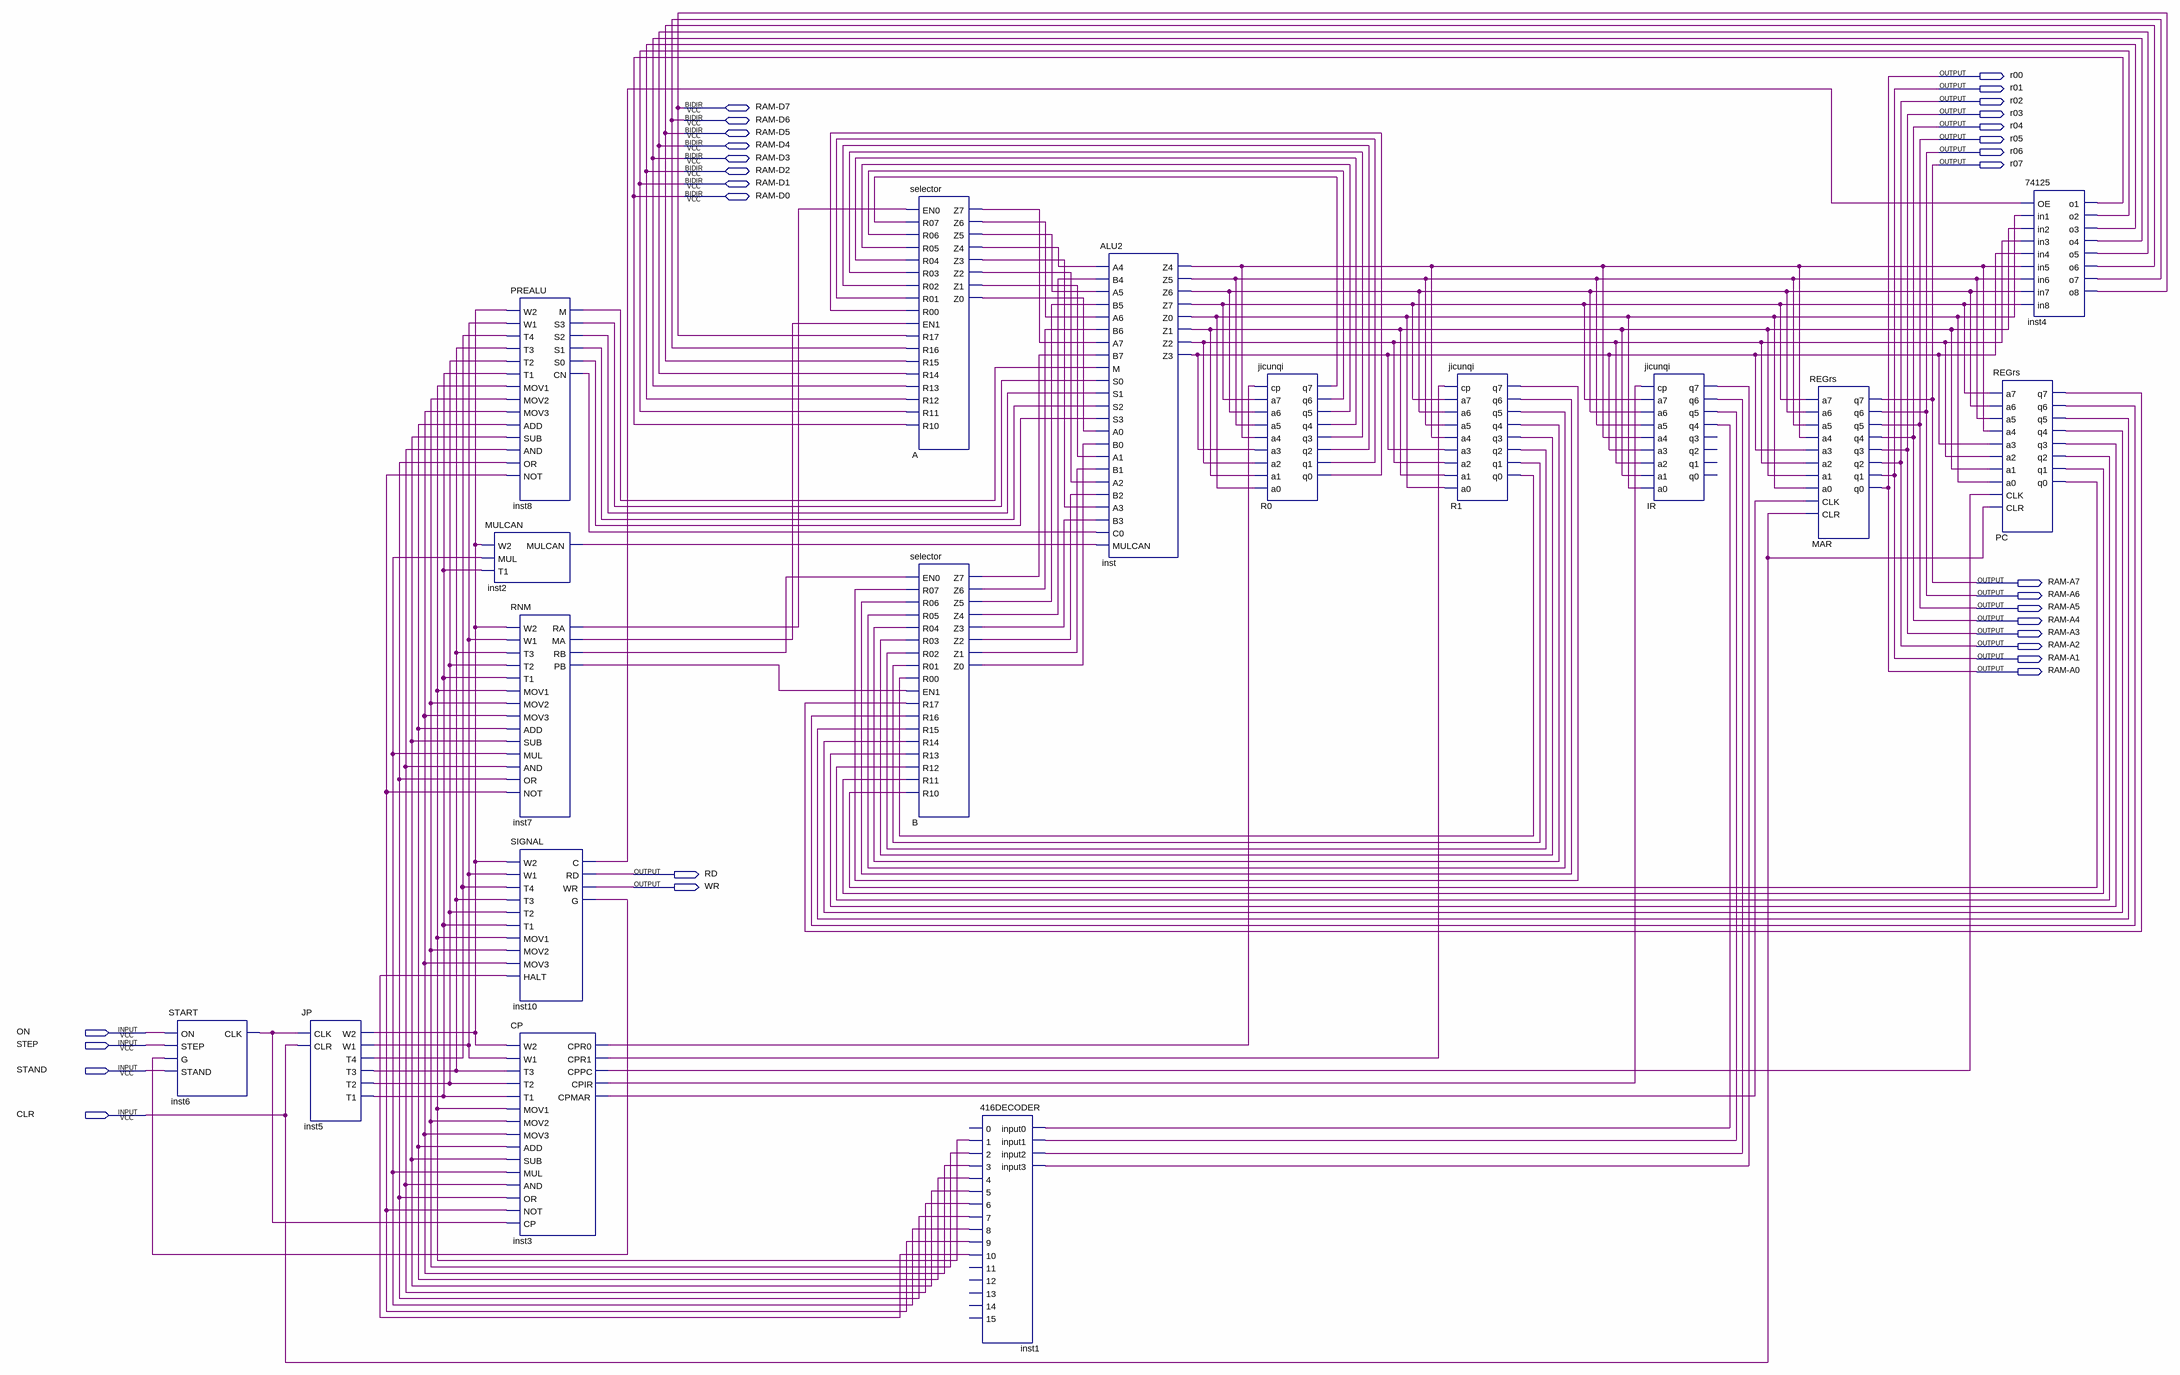
[diagram p0: schematic sheet]
// Quartus schematic LiningMachine.bdf as structural Verilog: 17 symbols, 30 pins
module LiningMachine (
  input  ON,
  input  STEP,
  input  STAND,
  input  CLR,
  inout  \RAM-D7 ,
  inout  \RAM-D6 ,
  inout  \RAM-D5 ,
  inout  \RAM-D4 ,
  inout  \RAM-D3 ,
  inout  \RAM-D2 ,
  inout  \RAM-D1 ,
  inout  \RAM-D0 ,
  output r00,
  output r01,
  output r02,
  output r03,
  output r04,
  output r05,
  output r06,
  output r07,
  output \RAM-A7 ,
  output \RAM-A6 ,
  output \RAM-A5 ,
  output \RAM-A4 ,
  output \RAM-A3 ,
  output \RAM-A2 ,
  output \RAM-A1 ,
  output \RAM-A0 ,
  output RD,
  output WR
);

  wire A_z0, A_z1, A_z2, A_z3, A_z4, A_z5, A_z6, A_z7, B_z0, B_z1, B_z2, B_z3, B_z4, B_z5, B_z6, B_z7,
       inst1_1, inst1_2, inst1_3, inst1_4, inst1_5, inst1_6, inst1_7, inst1_8, inst1_9, inst1_10,
       inst2_mulcan, inst3_cpir, inst3_cpmar, inst3_cppc, inst3_cpr0, inst3_cpr1, inst5_t1, inst5_t2,
       inst5_t3, inst5_t4, inst5_w1, inst5_w2, inst6_clk, inst7_ma, inst7_pb, inst7_ra, inst7_rb, inst8_cn,
       inst8_m, inst8_s0, inst8_s1, inst8_s2, inst8_s3, inst10_c, inst10_g, inst_z0, inst_z1, inst_z2,
       inst_z3, inst_z4, inst_z5, inst_z6, inst_z7, IR_q4, IR_q5, IR_q6, IR_q7, PC_q0, PC_q1, PC_q2, PC_q3,
       PC_q4, PC_q5, PC_q6, PC_q7, R0_q0, R0_q1, R0_q2, R0_q3, R0_q4, R0_q5, R0_q6, R0_q7, R1_q0, R1_q1,
       R1_q2, R1_q3, R1_q4, R1_q5, R1_q6, R1_q7;

  START inst6 (.ON(ON), .STEP(STEP), .G(inst10_g), .STAND(STAND), .CLK(inst6_clk));
  JP inst5 (
    .CLK(inst6_clk), .CLR(CLR), .W2(inst5_w2), .W1(inst5_w1), .T4(inst5_t4), .T3(inst5_t3), .T2(inst5_t2),
    .T1(inst5_t1));
  PREALU inst8 (
    .W2(inst5_w2), .W1(inst5_w1), .T4(inst5_t4), .T3(inst5_t3), .T2(inst5_t2), .T1(inst5_t1), .MOV1(inst1_1),
    .MOV2(inst1_2), .MOV3(inst1_3), .ADD(inst1_4), .SUB(inst1_5), .AND(inst1_6), .OR(inst1_7), .NOT(inst1_9),
    .M(inst8_m), .S3(inst8_s3), .S2(inst8_s2), .S1(inst8_s1), .S0(inst8_s0), .CN(inst8_cn));
  MULCAN inst2 (.W2(inst5_w2), .MUL(inst1_8), .T1(inst5_t1), .MULCAN(inst2_mulcan));
  RNM inst7 (
    .W2(inst5_w2), .W1(inst5_w1), .T3(inst5_t3), .T2(inst5_t2), .T1(inst5_t1), .MOV1(inst1_1),
    .MOV2(inst1_2), .MOV3(inst1_3), .ADD(inst1_4), .SUB(inst1_5), .MUL(inst1_8), .AND(inst1_6), .OR(inst1_7),
    .NOT(inst1_9), .RA(inst7_ra), .MA(inst7_ma), .RB(inst7_rb), .PB(inst7_pb));
  SIGNAL inst10 (
    .W2(inst5_w2), .W1(inst5_w1), .T4(inst5_t4), .T3(inst5_t3), .T2(inst5_t2), .T1(inst5_t1), .MOV1(inst1_1),
    .MOV2(inst1_2), .MOV3(inst1_3), .HALT(inst1_10), .C(inst10_c), .RD(RD), .WR(WR), .G(inst10_g));
  CP inst3 (
    .W2(inst5_w2), .W1(inst5_w1), .T3(inst5_t3), .T2(inst5_t2), .T1(inst5_t1), .MOV1(inst1_1),
    .MOV2(inst1_2), .MOV3(inst1_3), .ADD(inst1_4), .SUB(inst1_5), .MUL(inst1_8), .AND(inst1_6), .OR(inst1_7),
    .NOT(inst1_9), .CP(inst6_clk), .CPR0(inst3_cpr0), .CPR1(inst3_cpr1), .CPPC(inst3_cppc),
    .CPIR(inst3_cpir), .CPMAR(inst3_cpmar));
  selector A (
    .EN0(inst7_ra), .R07(R0_q7), .R06(R0_q6), .R05(R0_q5), .R04(R0_q4), .R03(R0_q3), .R02(R0_q2),
    .R01(R0_q1), .R00(R0_q0), .EN1(inst7_ma), .R17(\RAM-D7 ), .R16(\RAM-D6 ), .R15(\RAM-D5 ), .R14(\RAM-D4 ),
    .R13(\RAM-D3 ), .R12(\RAM-D2 ), .R11(\RAM-D1 ), .R10(\RAM-D0 ), .Z7(A_z7), .Z6(A_z6), .Z5(A_z5),
    .Z4(A_z4), .Z3(A_z3), .Z2(A_z2), .Z1(A_z1), .Z0(A_z0));
  selector B (
    .EN0(inst7_rb), .R07(R1_q7), .R06(R1_q6), .R05(R1_q5), .R04(R1_q4), .R03(R1_q3), .R02(R1_q2),
    .R01(R1_q1), .R00(R1_q0), .EN1(inst7_pb), .R17(PC_q7), .R16(PC_q6), .R15(PC_q5), .R14(PC_q4),
    .R13(PC_q3), .R12(PC_q2), .R11(PC_q1), .R10(PC_q0), .Z7(B_z7), .Z6(B_z6), .Z5(B_z5), .Z4(B_z4),
    .Z3(B_z3), .Z2(B_z2), .Z1(B_z1), .Z0(B_z0));
  \416DECODER  inst1 (
    .input0(IR_q4), .input1(IR_q5), .input2(IR_q6), .input3(IR_q7), .\1 (inst1_1), .\2 (inst1_2),
    .\3 (inst1_3), .\4 (inst1_4), .\5 (inst1_5), .\6 (inst1_6), .\7 (inst1_7), .\8 (inst1_8), .\9 (inst1_9),
    .\10 (inst1_10));  // open: 0, 11, 12, 13, 14, 15
  ALU2 inst (
    .A4(A_z4), .B4(B_z4), .A5(A_z5), .B5(B_z5), .A6(A_z6), .B6(B_z6), .A7(A_z7), .B7(B_z7), .M(inst8_m),
    .S0(inst8_s3), .S1(inst8_s2), .S2(inst8_s1), .S3(inst8_s0), .A0(A_z0), .B0(B_z0), .A1(A_z1), .B1(B_z1),
    .A2(A_z2), .B2(B_z2), .A3(A_z3), .B3(B_z3), .C0(inst8_cn), .MULCAN(inst2_mulcan), .Z4(inst_z4),
    .Z5(inst_z5), .Z6(inst_z6), .Z7(inst_z7), .Z0(inst_z0), .Z1(inst_z1), .Z2(inst_z2), .Z3(inst_z3));
  jicunqi R0 (
    .cp(inst3_cpr0), .a7(inst_z7), .a6(inst_z6), .a5(inst_z5), .a4(inst_z4), .a3(inst_z3), .a2(inst_z2),
    .a1(inst_z1), .a0(inst_z0), .q7(R0_q7), .q6(R0_q6), .q5(R0_q5), .q4(R0_q4), .q3(R0_q3), .q2(R0_q2),
    .q1(R0_q1), .q0(R0_q0));
  jicunqi R1 (
    .cp(inst3_cpr1), .a7(inst_z7), .a6(inst_z6), .a5(inst_z5), .a4(inst_z4), .a3(inst_z3), .a2(inst_z2),
    .a1(inst_z1), .a0(inst_z0), .q7(R1_q7), .q6(R1_q6), .q5(R1_q5), .q4(R1_q4), .q3(R1_q3), .q2(R1_q2),
    .q1(R1_q1), .q0(R1_q0));
  jicunqi IR (
    .cp(inst3_cpir), .a7(inst_z7), .a6(inst_z6), .a5(inst_z5), .a4(inst_z4), .a3(inst_z3), .a2(inst_z2),
    .a1(inst_z1), .a0(inst_z0), .q7(IR_q7), .q6(IR_q6), .q5(IR_q5), .q4(IR_q4));  // open: q3, q2, q1, q0
  REGrs MAR (
    .a7(inst_z7), .a6(inst_z6), .a5(inst_z5), .a4(inst_z4), .a3(inst_z3), .a2(inst_z2), .a1(inst_z1),
    .a0(inst_z0), .CLK(inst3_cpmar), .CLR(CLR), .q7(r07), .q6(r06), .q5(r05), .q4(r04), .q3(r03), .q2(r02),
    .q1(r01), .q0(r00));
  \74125  inst4 (
    .OE(inst10_c), .in1(inst_z0), .in2(inst_z1), .in3(inst_z2), .in4(inst_z3), .in5(inst_z4), .in6(inst_z5),
    .in7(inst_z6), .in8(inst_z7), .o1(\RAM-D0 ), .o2(\RAM-D1 ), .o3(\RAM-D2 ), .o4(\RAM-D3 ), .o5(\RAM-D4 ),
    .o6(\RAM-D5 ), .o7(\RAM-D6 ), .o8(\RAM-D7 ));
  REGrs PC (
    .a7(inst_z7), .a6(inst_z6), .a5(inst_z5), .a4(inst_z4), .a3(inst_z3), .a2(inst_z2), .a1(inst_z1),
    .a0(inst_z0), .CLK(inst3_cppc), .CLR(CLR), .q7(PC_q7), .q6(PC_q6), .q5(PC_q5), .q4(PC_q4), .q3(PC_q3),
    .q2(PC_q2), .q1(PC_q1), .q0(PC_q0));

  assign \RAM-A0  = r00;
  assign \RAM-A1  = r01;
  assign \RAM-A2  = r02;
  assign \RAM-A3  = r03;
  assign \RAM-A4  = r04;
  assign \RAM-A5  = r05;
  assign \RAM-A6  = r06;
  assign \RAM-A7  = r07;
endmodule
